# EAGLE design circuito (EAGLE 7.7.0)
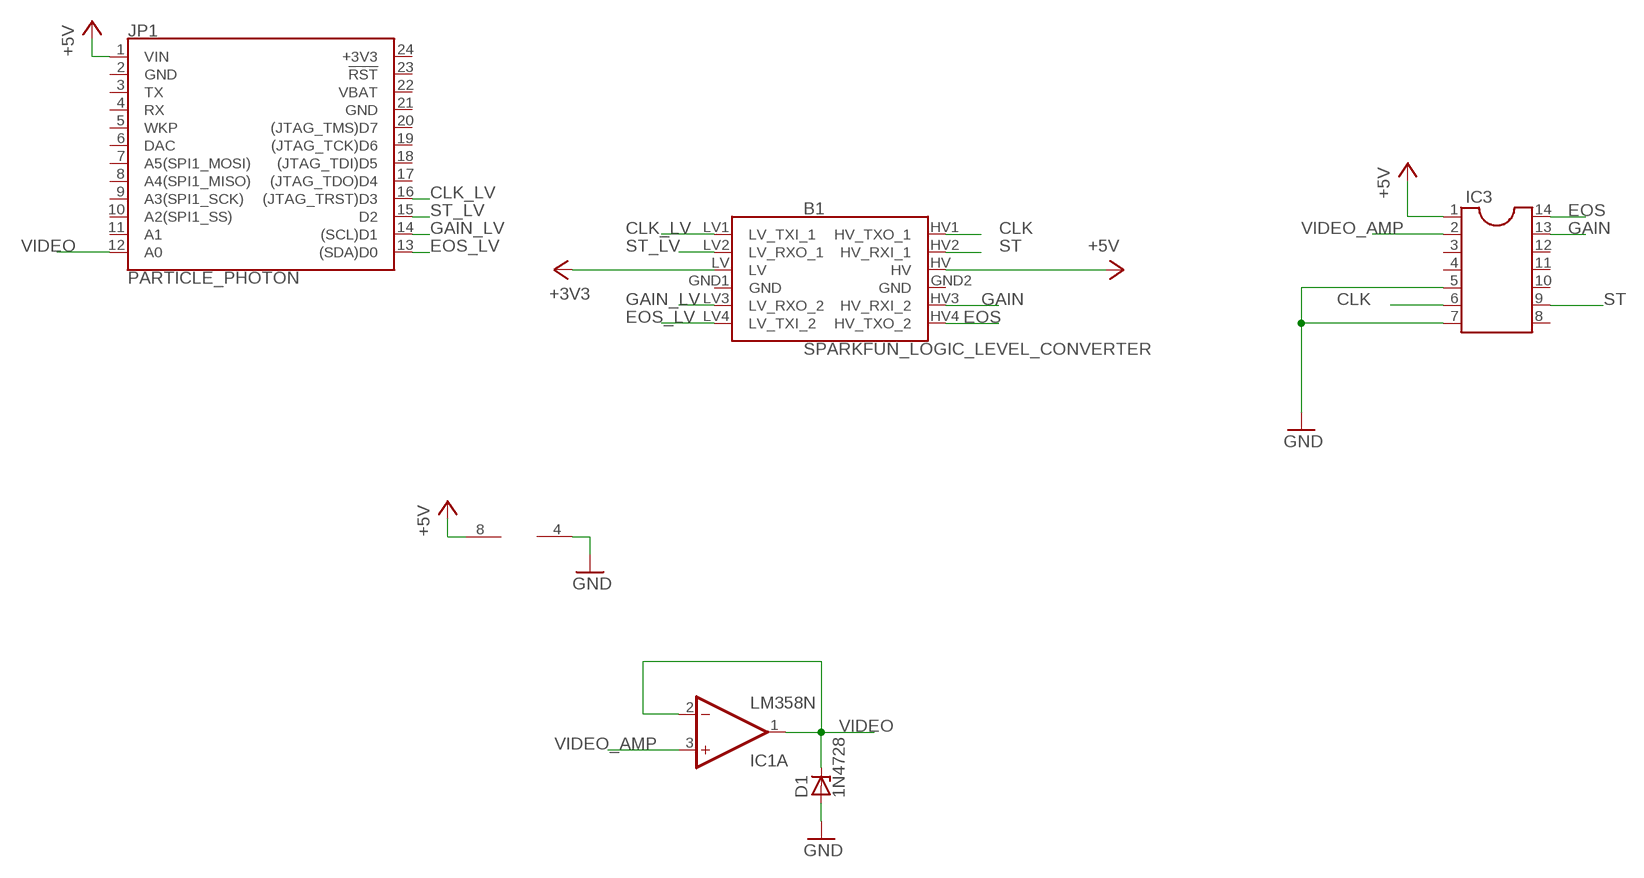
[diagram p0: schematic, sheet 1]

## Parts
B1  SPARKFUN_LOGIC_LEVEL_CONVERTER  [SPARKFUN_LOGIC_LEVEL_CONVERTER]
D1  1N4728  [DO41Z10]
IC1  LM358N  [DIL08]
IC3  DIL14S  [SOCKET-14]
JP1  PARTICLE_PHOTON  [PARTICLE_PHOTON]

## Nets
+3V3: B1.LV
+5V: B1.HV IC1.8(P:V+) IC3.1 JP1.1(VIN)
CLK: B1.HV1(HV_TXO_1) IC3.6
CLK_LV: B1.LV1(LV_TXI_1) JP1.16((JTAG_TRST)D3)
EOS: B1.HV4(HV_TXO_2) IC3.14
EOS_LV: B1.LV4(LV_TXI_2) JP1.13((SDA)D0)
GAIN: B1.HV3(HV_RXI_2) IC3.13
GAIN_LV: B1.LV3(LV_RXO_2) JP1.14((SCL)D1)
GND: D1.A IC1.4(P:V-) IC3.5 IC3.7
ST: B1.HV2(HV_RXI_1) IC3.9
ST_LV: B1.LV2(LV_RXO_1) JP1.15(D2)
VIDEO: D1.C IC1.1(A:OUT) IC1.2(A:-IN) JP1.12(A0)
VIDEO_AMP: IC1.3(A:+IN) IC3.2
Unconnected: IC1.5(B:+IN) IC1.6(B:-IN) IC1.7(B:OUT) IC3.3 IC3.4 IC3.8 IC3.10 IC3.11 IC3.12 JP1.3(TX) JP1.4(RX) JP1.5(WKP) JP1.6(DAC) JP1.7(A5(SPI1_MOSI)) JP1.8(A4(SPI1_MISO)) JP1.9(A3(SPI1_SCK)) JP1.10(A2(SPI1_SS)) JP1.11(A1) JP1.17((JTAG_TDO)D4) JP1.18((JTAG_TDI)D5) JP1.19((JTAG_TCK)D6) JP1.20((JTAG_TMS)D7) JP1.23(!RST!)

## Power pins joined to a net without a drawn wire
+3V3: JP1.24(+3V3)
GND: B1.GND1(GND) B1.GND2(GND) JP1.2(GND) JP1.21(GND)
VBAT: JP1.22(VBAT)

## Library data of the parts
B1 = SparkFun-Boards:SPARKFUN_LOGIC_LEVEL_CONVERTER: SparkFun Logic Level Converter -Bi-Directional This is the mechnical outline for the 3.3V - 5V bi directional logic level converter. SparkFun Products: SparkFun Logic Level Converter - Bi-Directional <https://www.sparkfun.com/products/12009>
D1 = diode:1N4728: Z DIODE 3.3 V, 1W, 5 percent
IC1 = linear:LM358: OP AMP also LM158; LM258; LM2904 Source: http://cache.national.com/ds/LM/LM158.pdf
IC3 = ic-package:DIL14: Dual In Line / Socket
JP1 = SparkFun-Boards:PARTICLE_PHOTON: Particle Photon Footprint of the Particle Photon that is used as a basis for many Photon shields. SparkFun Products: Particle Photon <https://www.sparkfun.com/products/13764> SparkFun Photon ProtoShield <https://www.sparkfun.com/products/13598> SparkFun Photon micro OLED Shield <https://www.sparkfun.com/products/13628> SparkFun Photon IMU Shield <https://www.sparkfun.com/products/13629> SparkFun Photon Battery Shield <https://www.sparkfun.com/products/13626>

## Board
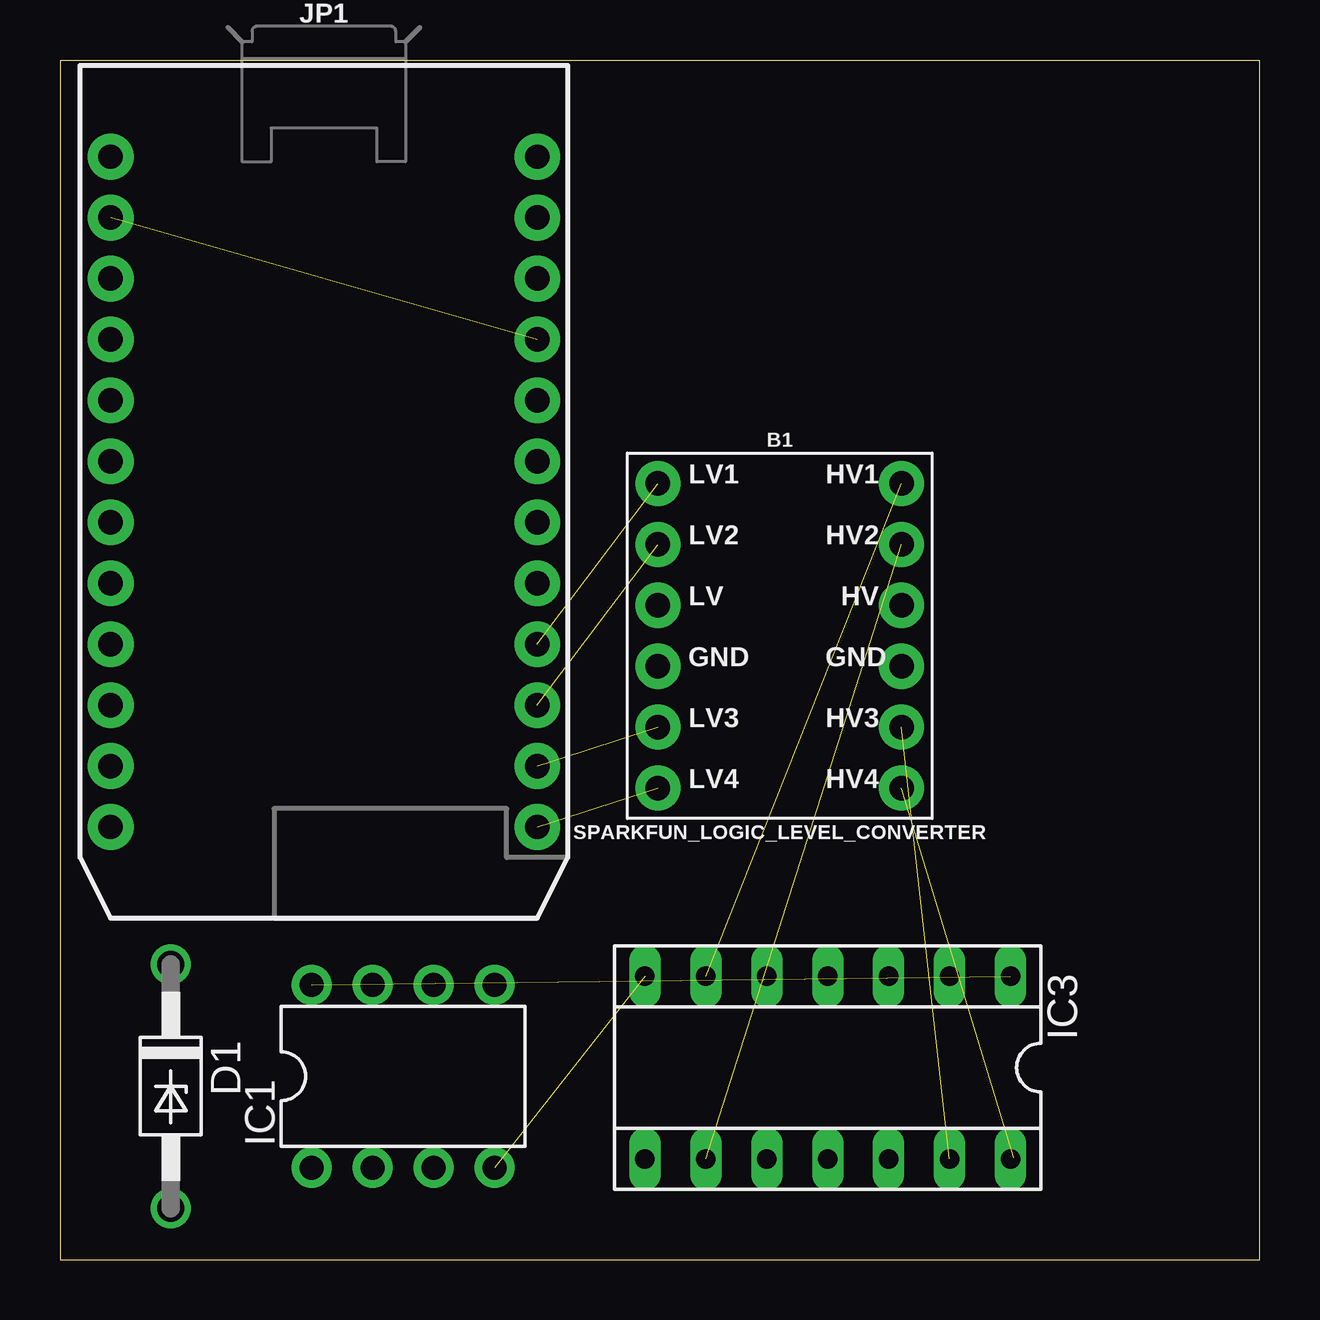
[diagram p1: board, top side]
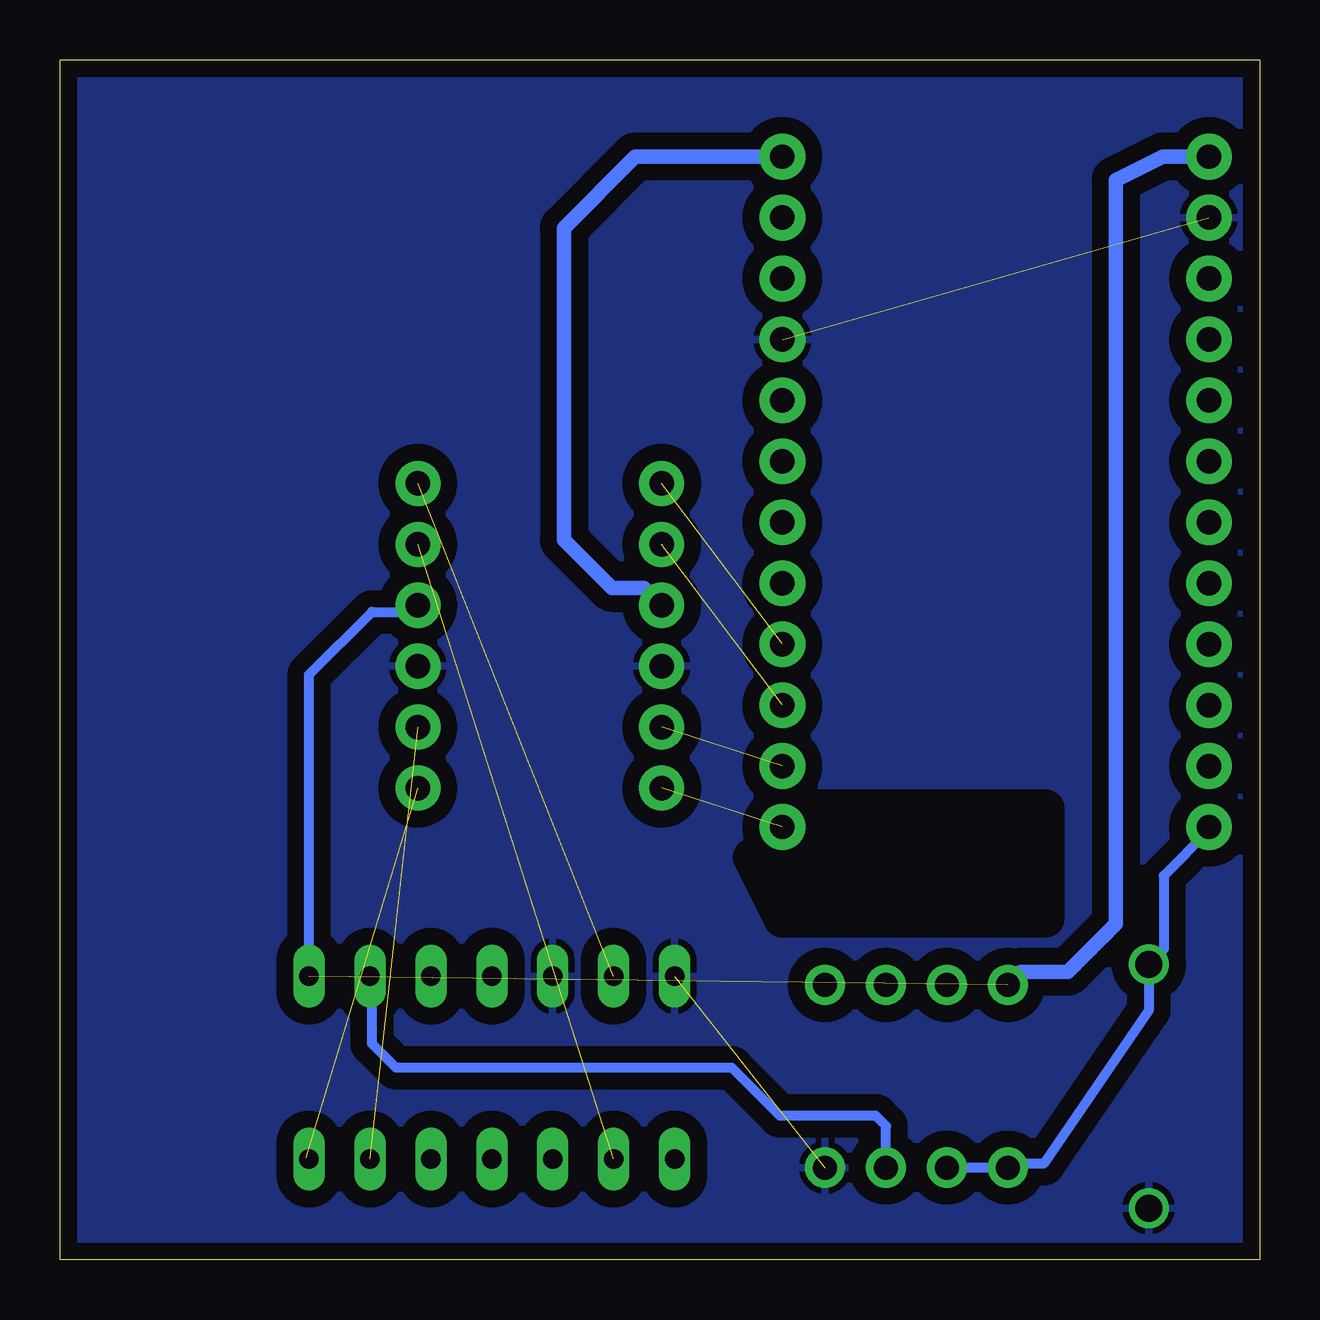
[diagram p2: board, bottom side, seen from below]

Size 50 x 50 mm. Coordinates in mm from the lower left corner, seen from the top.
Outline: 0,0 50,0 50,50 0,50 0,0
Copper layers (1*16): Top 0.035mm / dielectric 1.5mm / Bottom 0.035mm
Design rules "default *": minimum track width 0.4mm, minimum drill 0.8mm, track to track 8mil, track to pad 8mil, pad to pad 8mil, via to via 8mil, smd to smd 8mil, copper to edge 20mil, drill to drill 8mil, minimum pad ring 10mil, minimum via ring 8mil, stop-mask expansion 4mil, vias tented up to drill 0mil, thermal gap 10mil

### Footprints (pad centres in the part's own frame; a part is rotated, then mirrored left to right if it is on the bottom)
SPARKFUN_LOGIC_LEVEL_CONVERTER = drill 1.016 pad 1.88: GND1 -5.08,-1.27; GND2 5.08,-1.27; HV 5.08,1.27; HV1 5.08,6.35; HV2 5.08,3.81; HV3 5.08,-3.81; HV4 5.08,-6.35; LV -5.08,1.27; LV1 -5.08,6.35; LV2 -5.08,3.81; LV3 -5.08,-3.81; LV4 -5.08,-6.35
DO41Z10 = drill 1.118: A 5.08,0; C -5.08,0
DIL08 = drill 1 pad 1.676: 1 -3.81,-3.81; 2 -1.27,-3.81; 3 1.27,-3.81; 4 3.81,-3.81; 5 3.81,3.81; 6 1.27,3.81; 7 -1.27,3.81; 8 -3.81,3.81
SOCKET-14 = drill 0.813 long: 1 -7.62,-3.81; 2 -5.08,-3.81; 3 -2.54,-3.81; 4 0,-3.81; 5 2.54,-3.81; 6 5.08,-3.81; 7 7.62,-3.81; 8 7.62,3.81; 9 5.08,3.81; 10 2.54,3.81; 11 0,3.81; 12 -2.54,3.81; 13 -5.08,3.81; 14 -7.62,3.81
PARTICLE_PHOTON = drill 1.016 pad 1.905: 1 -8.89,13.97; 2 -8.89,11.43; 3 -8.89,8.89; 4 -8.89,6.35; 5 -8.89,3.81; 6 -8.89,1.27; 7 -8.89,-1.27; 8 -8.89,-3.81; 9 -8.89,-6.35; 10 -8.89,-8.89; 11 -8.89,-11.43; 12 -8.89,-13.97; 13 8.89,-13.97; 14 8.89,-11.43; 15 8.89,-8.89; 16 8.89,-6.35; 17 8.89,-3.81; 18 8.89,-1.27; 19 8.89,1.27; 20 8.89,3.81; 21 8.89,6.35; 22 8.89,8.89; 23 8.89,11.43; 24 8.89,13.97

### Placement (x,y rotation side)
B1  30,26 0 top
D1  4.62,7.22 270 top
IC1  14.3,7.64 0 top
IC3  32,8 180 top
JP1  11,32 0 top

### Tracks (layer width: path | path; a pad name or v marks a point on that pad's centre or on a via)
+3V3
  Bottom 0.61: JP1.24 26.03,45.97 29,43 29,30 27,28 25.65,28 B1.LV
+5V  (1 unrouted)
  Bottom 0.406: IC3.1 39.62,24.38 37,27 35.35,27 B1.HV
  Bottom 0.61: JP1.1 4.03,45.97 6,45 6,14 8,12 9.94,12 IC1.8
CLK  (1 unrouted)
CLK_LV  (1 unrouted)
EOS  (1 unrouted)
  Bottom 0.4: 39.75,4.25 IC3.14
EOS_LV  (1 unrouted)
GAIN  (1 unrouted)
GAIN_LV  (1 unrouted)
GND  (2 unrouted)
  pour Bottom (isolate 0.7): 0,0 0,50 50,50 50,0
ST  (1 unrouted)
ST_LV  (1 unrouted)
VIDEO
  Bottom 0.406: IC1.2 IC1.1 10.32,4 9,4 4.62,10.38 D1.C 4,12.92 4,16 2.11,17.89 JP1.12
VIDEO_AMP
  Bottom 0.406: IC1.3 15.57,5.57 16,6 20,6 22,8 36,8 37,9 37,11.73 IC3.2